# Altium schematic sheet Motor_regulators.SchDoc
size A4
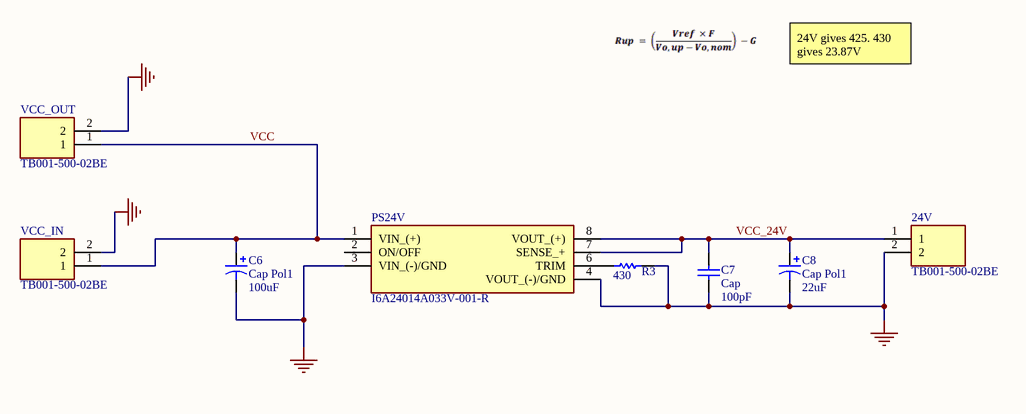
[diagram p0: Motor_regulators.SchDoc]

## Parts
24V  TB001-500-02BE  [TB00150002BE]
C6  Cap Pol1  value 100uF  [RB7.6-15]
C7  Cap  value 100pF  [RAD-0.3]
C8  Cap Pol1  value 22uF  [RB7.6-15]
PS24V  I6A24014A033V-001-R  [I6A24014A033V001R]
R3  value 430  [AXIAL-0.3]  (hidden comment: Rup)
VCC_IN  TB001-500-02BE  [TB00150002BE]
VCC_OUT  TB001-500-02BE  [TB00150002BE]

## Nets
GND: 24V.2 C6.2 C7.1 C8.2 PS24V.3(VIN_(-)/GND) PS24V.4(VOUT_(-)/GND) R3.1 VCC_IN.2 VCC_OUT.2
VCC: C6.1 PS24V.1(VIN_(+)) VCC_IN.1 VCC_OUT.1
VCC_24V: 24V.1 C7.2 C8.1 PS24V.7(SENSE_+) PS24V.8(VOUT_(+))
NetPS24V_6: PS24V.6(TRIM) R3.2

Not connected (* = marked no-connect by the designer): PS24V 2(ON/OFF)

## Notes on the sheet
- 24V gives 425. 430 gives 23.87V

## Library data of the parts
24V VCC_IN VCC_OUT = TB001-500-02BE: Integrated Circuit; Manufacturer_Name: CUI Inc.; Datasheet Link: https://componentsearchengine.com//TB001-500-02BE.pdf; Height: 12.9mm; Mouser2 Part Number: 490-TB001-500-02BE; Mouser2 Price/Stock: https://www.mouser.com/Search/Refine.aspx?Keyword=490-TB001-500-02BE; Manufacturer_Part_Number: TB001-500-02BE
C6 C8 = Cap Pol1: Polarized Capacitor (Radial); Published: 8-Jun-2000; LatestRevisionDate: 17-Jul-2002; LatestRevisionNote: Re-released for DXP Platform.; PackageReference: RB7.6-15; Publisher: Altium Limited; PackageDescription: Polarized Capacitor (Radial); 2 Leads
C7 = Cap: Capacitor; Published: 8-Jun-2000; LatestRevisionDate: 17-Jul-2002; LatestRevisionNote: Re-released for DXP Platform.; PackageReference: RAD-0.3; Publisher: Altium Limited; PackageDescription: Radial Cap, Thru-Hole; 2 Leads; 0.3 in Pin Spacing
PS24V = I6A24014A033V-001-R: Power Supply; Manufacturer_Name: TDK; Datasheet Link: https://componentsearchengine.com//I6A24014A033V-001-R.pdf; Height: 12.1mm; Mouser2 Part Number: 967-I6A24014A033V001; Mouser2 Price/Stock: https://www.mouser.com/Search/Refine.aspx?Keyword=967-I6A24014A033V001; Manufacturer_Part_Number: I6A24014A033V-001-R
R3 = Res1: Resistor; Published: 8-Jun-2000; LatestRevisionDate: 17-Jul-2002; LatestRevisionNote: Re-released for DXP Platform.; PackageReference: AXIAL-0.3; Publisher: Altium Limited; PackageDescription: Axial Device, Thru-Hole; 2 Leads; 0.3 in Pin Spacing